# Altium schematic sheet S7CAS-PLEIADES-CARTE-MERE_Pxx_POWER_FPGA.SchDoc
size Tabloid; SheetNumber: 7; SheetTotal: 18; Sheet_Name: POWER FPGA; Size: 11x17
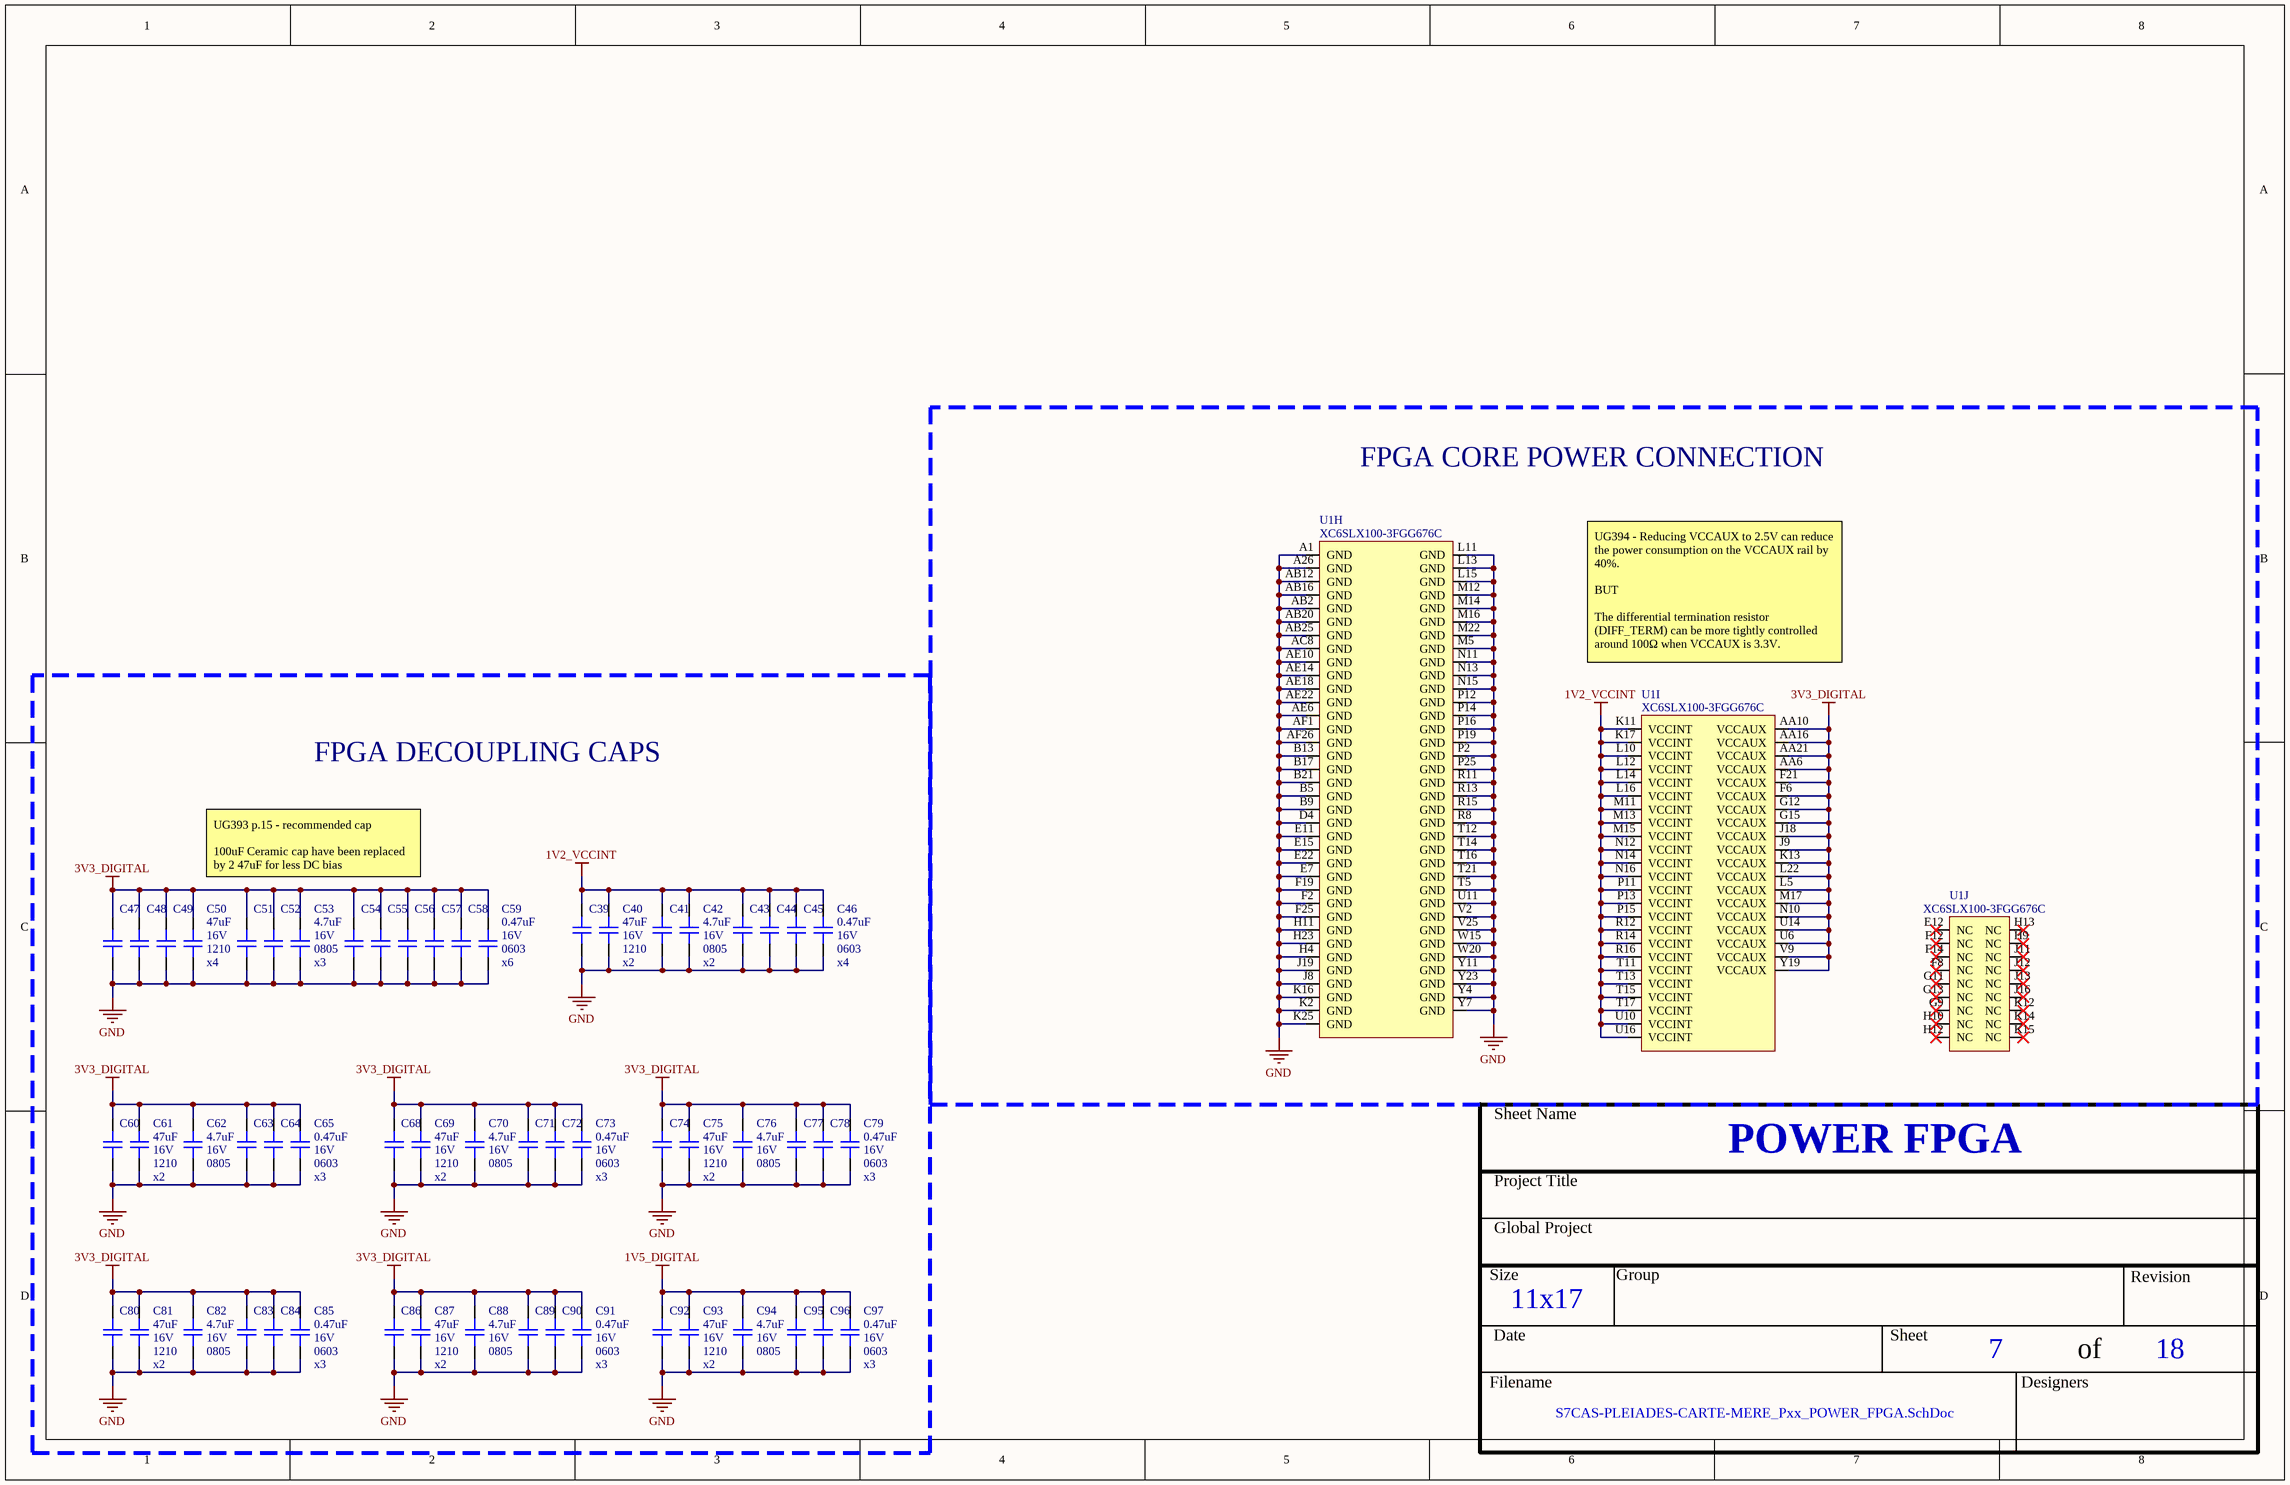
[diagram p0: S7CAS-PLEIADES-CARTE-MERE_Pxx_POWER_FPGA.SchDoc]

## Parts
C39  CAP - 1210  [CAP_1210]  (value not drawn)
C40  value 47uF  Voltage: 16V  Package: 1210  [CAP_1210]  (hidden comment: CAP - 1210)
C41  CAP - 0805  [CAP_0805]  (value not drawn)
C42  value 4.7uF  Voltage: 16V  Package: 0805  [CAP_0805]  (hidden comment: CAP - 0805)
C43  CAP - 0603  [CAP_0603]  (value not drawn)
C44  CAP - 0603  [CAP_0603]  (value not drawn)
C45  CAP - 0603  [CAP_0603]  (value not drawn)
C46  value 0.47uF  Voltage: 16V  Package: 0603  [CAP_0603]  (hidden comment: CAP - 0603)
C47  CAP - 1210  [CAP_1210]  (value not drawn)
C48  CAP - 1210  [CAP_1210]  (value not drawn)
C49  CAP - 1210  [CAP_1210]  (value not drawn)
C50  value 47uF  Voltage: 16V  Package: 1210  [CAP_1210]  (hidden comment: CAP - 1210)
C51  CAP - 0805  [CAP_0805]  (value not drawn)
C52  CAP - 0805  [CAP_0805]  (value not drawn)
C53  value 4.7uF  Voltage: 16V  Package: 0805  [CAP_0805]  (hidden comment: CAP - 0805)
C54  CAP - 0603  [CAP_0603]  (value not drawn)
C55  CAP - 0603  [CAP_0603]  (value not drawn)
C56  CAP - 0603  [CAP_0603]  (value not drawn)
C57  CAP - 0603  [CAP_0603]  (value not drawn)
C58  CAP - 0603  [CAP_0603]  (value not drawn)
C59  value 0.47uF  Voltage: 16V  Package: 0603  [CAP_0603]  (hidden comment: CAP - 0603)
C60  CAP - 1210  [CAP_1210]  (value not drawn)
C61  value 47uF  Voltage: 16V  Package: 1210  [CAP_1210]  (hidden comment: CAP - 1210)
C62  value 4.7uF  Voltage: 16V  Package: 0805  [CAP_0805]  (hidden comment: CAP - 0805)
C63  CAP - 0603  [CAP_0603]  (value not drawn)
C64  CAP - 0603  [CAP_0603]  (value not drawn)
C65  value 0.47uF  Voltage: 16V  Package: 0603  [CAP_0603]  (hidden comment: CAP - 0603)
C68  CAP - 1210  [CAP_1210]  (value not drawn)
C69  value 47uF  Voltage: 16V  Package: 1210  [CAP_1210]  (hidden comment: CAP - 1210)
C70  value 4.7uF  Voltage: 16V  Package: 0805  [CAP_0805]  (hidden comment: CAP - 0805)
C71  CAP - 0603  [CAP_0603]  (value not drawn)
C72  CAP - 0603  [CAP_0603]  (value not drawn)
C73  value 0.47uF  Voltage: 16V  Package: 0603  [CAP_0603]  (hidden comment: CAP - 0603)
C74  CAP - 1210  [CAP_1210]  (value not drawn)
C75  value 47uF  Voltage: 16V  Package: 1210  [CAP_1210]  (hidden comment: CAP - 1210)
C76  value 4.7uF  Voltage: 16V  Package: 0805  [CAP_0805]  (hidden comment: CAP - 0805)
C77  CAP - 0603  [CAP_0603]  (value not drawn)
C78  CAP - 0603  [CAP_0603]  (value not drawn)
C79  value 0.47uF  Voltage: 16V  Package: 0603  [CAP_0603]  (hidden comment: CAP - 0603)
C80  CAP - 1210  [CAP_1210]  (value not drawn)
C81  value 47uF  Voltage: 16V  Package: 1210  [CAP_1210]  (hidden comment: CAP - 1210)
C82  value 4.7uF  Voltage: 16V  Package: 0805  [CAP_0805]  (hidden comment: CAP - 0805)
C83  CAP - 0603  [CAP_0603]  (value not drawn)
C84  CAP - 0603  [CAP_0603]  (value not drawn)
C85  value 0.47uF  Voltage: 16V  Package: 0603  [CAP_0603]  (hidden comment: CAP - 0603)
C86  CAP - 1210  [CAP_1210]  (value not drawn)
C87  value 47uF  Voltage: 16V  Package: 1210  [CAP_1210]  (hidden comment: CAP - 1210)
C88  value 4.7uF  Voltage: 16V  Package: 0805  [CAP_0805]  (hidden comment: CAP - 0805)
C89  CAP - 0603  [CAP_0603]  (value not drawn)
C90  CAP - 0603  [CAP_0603]  (value not drawn)
C91  value 0.47uF  Voltage: 16V  Package: 0603  [CAP_0603]  (hidden comment: CAP - 0603)
C92  CAP - 1210  [CAP_1210]  (value not drawn)
C93  value 47uF  Voltage: 16V  Package: 1210  [CAP_1210]  (hidden comment: CAP - 1210)
C94  value 4.7uF  Voltage: 16V  Package: 0805  [CAP_0805]  (hidden comment: CAP - 0805)
C95  CAP - 0603  [CAP_0603]  (value not drawn)
C96  CAP - 0603  [CAP_0603]  (value not drawn)
C97  value 0.47uF  Voltage: 16V  Package: 0603  [CAP_0603]  (hidden comment: CAP - 0603)
U1  XC6SLX100-3FGG676C  [FPGA_XILINX_FGG676]  (parts H,I,J of 10)

## Blocks framed on the sheet
FPGA CORE POWER CONNECTION: U1
FPGA DECOUPLING CAPS: C39-C65 C68-C97

## Nets
1V2_VCCINT: C39.2 C40.2 C41.2 C42.2 C43.2 C44.2 C45.2 C46.2 U1.K11(VCCINT) U1.K17(VCCINT) U1.L10(VCCINT) U1.L12(VCCINT) U1.L14(VCCINT) U1.L16(VCCINT) U1.M11(VCCINT) U1.M13(VCCINT) U1.M15(VCCINT) U1.N12(VCCINT) U1.N14(VCCINT) U1.N16(VCCINT) U1.P11(VCCINT) U1.P13(VCCINT) U1.P15(VCCINT) U1.R12(VCCINT) U1.R14(VCCINT) U1.R16(VCCINT) U1.T11(VCCINT) U1.T13(VCCINT) U1.T15(VCCINT) U1.T17(VCCINT) U1.U10(VCCINT) U1.U16(VCCINT)
1V5_DIGITAL: C92.2 C93.2 C94.2 C95.2 C96.2 C97.2
3V3_DIGITAL: C47.2 C48.2 C49.2 C50.2 C51.2 C52.2 C53.2 C54.2 C55.2 C56.2 C57.2 C58.2 C59.2 C60.2 C61.2 C62.2 C63.2 C64.2 C65.2 C68.2 C69.2 C70.2 C71.2 C72.2 C73.2 C74.2 C75.2 C76.2 C77.2 C78.2 C79.2 C80.2 C81.2 C82.2 C83.2 C84.2 C85.2 C86.2 C87.2 C88.2 C89.2 C90.2 C91.2 U1.AA6(VCCAUX) U1.AA10(VCCAUX) U1.AA16(VCCAUX) U1.AA21(VCCAUX) U1.F6(VCCAUX) U1.F21(VCCAUX) U1.G12(VCCAUX) U1.G15(VCCAUX) U1.J9(VCCAUX) U1.J18(VCCAUX) U1.K13(VCCAUX) U1.L5(VCCAUX) U1.L22(VCCAUX) U1.M17(VCCAUX) U1.N10(VCCAUX) U1.U6(VCCAUX) U1.U14(VCCAUX) U1.V9(VCCAUX) U1.Y19(VCCAUX)
GND: C39.1 C40.1 C41.1 C42.1 C43.1 C44.1 C45.1 C46.1 C47.1 C48.1 C49.1 C50.1 C51.1 C52.1 C53.1 C54.1 C55.1 C56.1 C57.1 C58.1 C59.1 C60.1 C61.1 C62.1 C63.1 C64.1 C65.1 C68.1 C69.1 C70.1 C71.1 C72.1 C73.1 C74.1 C75.1 C76.1 C77.1 C78.1 C79.1 C80.1 C81.1 C82.1 C83.1 C84.1 C85.1 C86.1 C87.1 C88.1 C89.1 C90.1 C91.1 C92.1 C93.1 C94.1 C95.1 C96.1 C97.1 U1.A1(GND) U1.A26(GND) U1.AB2(GND) U1.AB12(GND) U1.AB16(GND) U1.AB20(GND) U1.AB25(GND) U1.AC8(GND) U1.AE6(GND) U1.AE10(GND) U1.AE14(GND) U1.AE18(GND) U1.AE22(GND) U1.AF1(GND) U1.AF26(GND) U1.B5(GND) U1.B9(GND) U1.B13(GND) U1.B17(GND) U1.B21(GND) U1.D4(GND) U1.E7(GND) U1.E11(GND) U1.E15(GND) U1.E22(GND) U1.F2(GND) U1.F19(GND) U1.F25(GND) U1.H4(GND) U1.H11(GND) U1.H23(GND) U1.J8(GND) U1.J19(GND) U1.K2(GND) U1.K16(GND) U1.K25(GND) U1.L11(GND) U1.L13(GND) U1.L15(GND) U1.M5(GND) U1.M12(GND) U1.M14(GND) U1.M16(GND) U1.M22(GND) U1.N11(GND) U1.N13(GND) U1.N15(GND) U1.P2(GND) U1.P12(GND) U1.P14(GND) U1.P16(GND) U1.P19(GND) U1.P25(GND) U1.R8(GND) U1.R11(GND) U1.R13(GND) U1.R15(GND) U1.T5(GND) U1.T12(GND) U1.T14(GND) U1.T16(GND) U1.T21(GND) U1.U11(GND) U1.V2(GND) U1.V25(GND) U1.W15(GND) U1.W20(GND) U1.Y4(GND) U1.Y7(GND) U1.Y11(GND) U1.Y23(GND)

Not connected (* = marked no-connect by the designer): U1 E12(NC)* F8(NC)* F12(NC)* F14(NC)* G9(NC)* G11(NC)* G13(NC)* H9(NC)* H10(NC)* H12(NC)* H13(NC)* J11(NC)* J12(NC)* J13(NC)* J16(NC)* K12(NC)* K14(NC)* K15(NC)*

## Notes on the sheet
- UG394 - Reducing VCCAUX to 2.5V can reduce the power consumption on the VCCAUX rail by 40%.
  BUT
  The differential termination resistor (DIFF_TERM) can be more tightly controlled around 100Ω when VCCAUX is 3.3V.
- UG393 p.15 - recommended cap
  100uF Ceramic cap have been replaced by 2 47uF for less DC bias
- (near C50) x4
- (near C53) x3
- (near C59) x6
- x2
- (near C46) x4
- (near C65) x3
- (near C73) x3
- (near C79) x3
- (near C85) x3
- (near C91) x3
- (near C97) x3
- Sheet Name
- Project Title
- Global Project
- Size
- Group
- Revision
- Date
- Sheet
- of
- Filename
- Designers

## Library data of the parts
C39 C47-C49 C60 C68 C74 C80 C86 C92 = CAP - 1210: Precision: 10%; Voltage: 16V; Value: 47uF; Current: *; CreatedBy: Jonathan Bouchard; Power: *; Package: 1210; Supplier 1: Arrow Electronics; Supplier Part Number 1: CL32A476KOJNNNE
C40 C50 C61 C69 C75 C81 C87 C93 = CAP - 1210: Precision: 10%; Current: *; CreatedBy: Jonathan Bouchard; Power: *; Supplier 1: Arrow Electronics; Supplier Part Number 1: CL32A476KOJNNNE
C41 C51 C52 = CAP - 0805: Precision: 10%; Voltage: 16V; Value: 4.7uF; Current: *; CreatedBy: Jonathan Bouchard; Power: *; Package: 0805; Supplier 1: Arrow Electronics; Supplier Part Number 1: CL21B475KOFNFNE
C42 C53 C62 C70 C76 C82 C88 C94 = CAP - 0805: Precision: 10%; Current: *; CreatedBy: Jonathan Bouchard; Power: *; Supplier 1: Arrow Electronics; Supplier Part Number 1: CL21B475KOFNFNE
C43-C45 C54-C58 C63 C64 C71 C72 C77 C78 C83 C84 C89 C90 C95 C96 = CAP - 0603: Precision: 10%; Voltage: 16V; Value: 0.47uF; Current: *; CreatedBy: Jonathan Bouchard; Power: *; Package: 0603; Supplier 1: Arrow Electronics; Supplier Part Number 1: C1608X7R1C474K080AC
C46 C59 C65 C73 C79 C85 C91 C97 = CAP - 0603: Precision: 10%; Current: *; CreatedBy: Jonathan Bouchard; Power: *; Supplier 1: Arrow Electronics; Supplier Part Number 1: C1608X7R1C474K080AC
U1 = FPGA_XC6SLX100-3FGG676C: FPGA - XILINX SPARTAN 6 480 I/O - BGA-676; Voltage: 1.14 V ~ 1.26 V; Current: *; Power: *; Mfg: Xilinx; Mfg Part Number: XC6SLX100-3FGG676C; HelpURL: https://www.xilinx.com/support/documentation/data_sheets/ds162.pdf; CreatedBy: Jonathan Bouchard; Temperature: 0°C ~ 85°C (TJ); Value: *; Precision: *; Package: BGA-676; Supplier 1: Digikey; Supplier Part Number 1: 122-1760-ND